# EAGLE board module (EAGLE 9.4.0), part 1 of 2
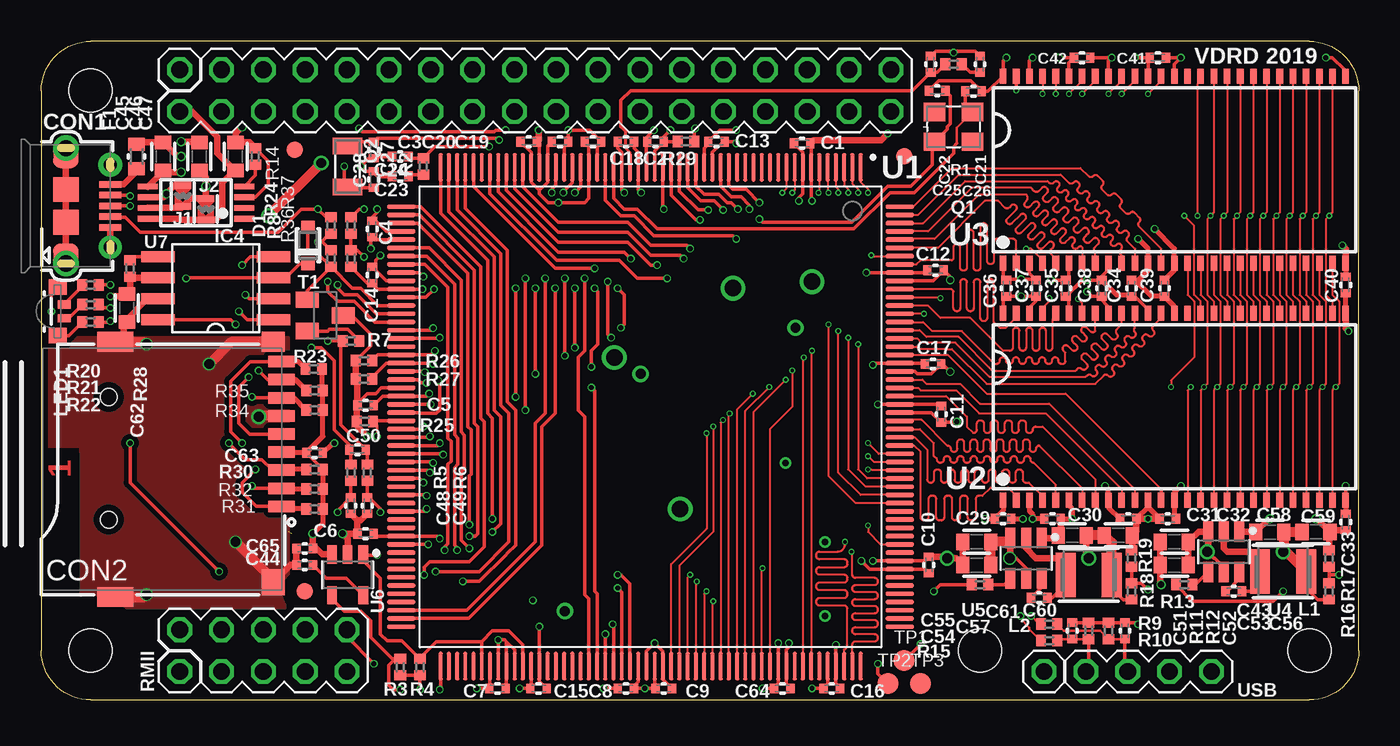
[diagram p5: board, top side]
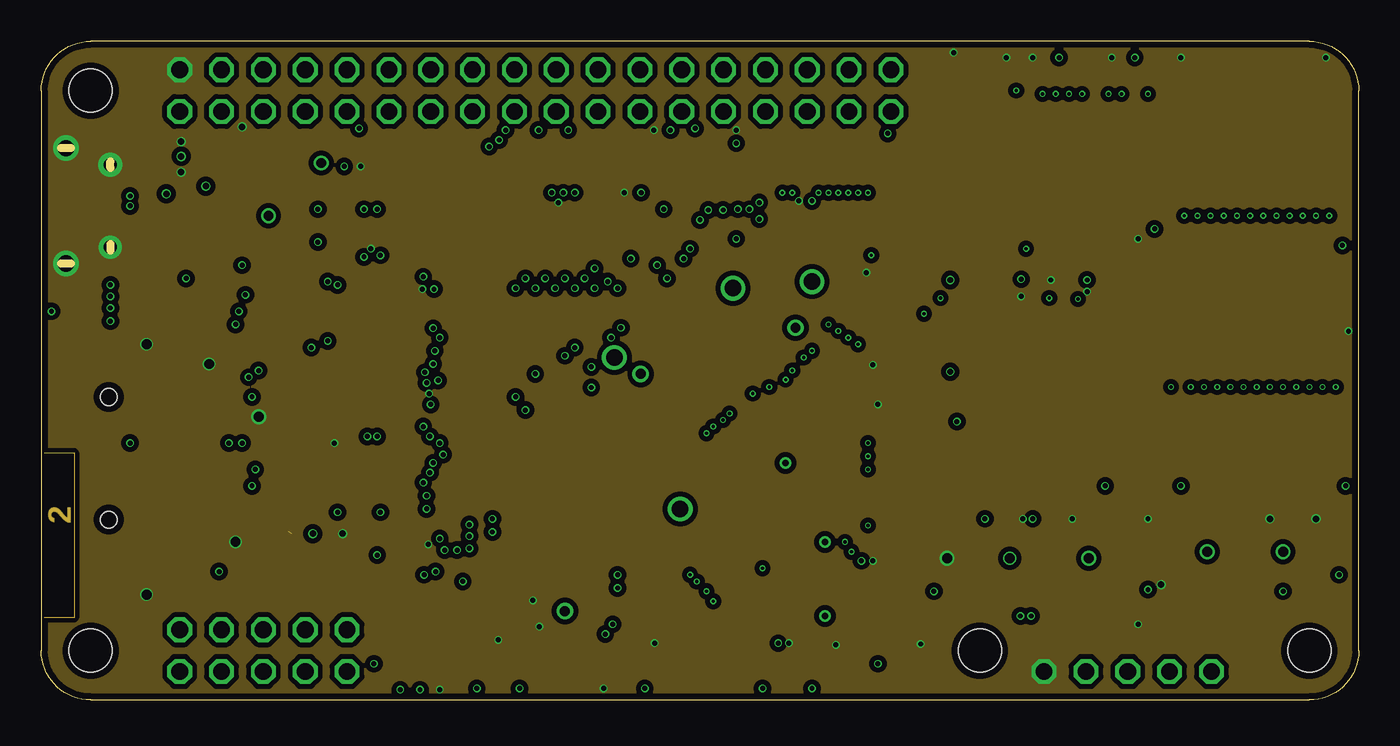
[diagram p6: board, inner layer Route2]
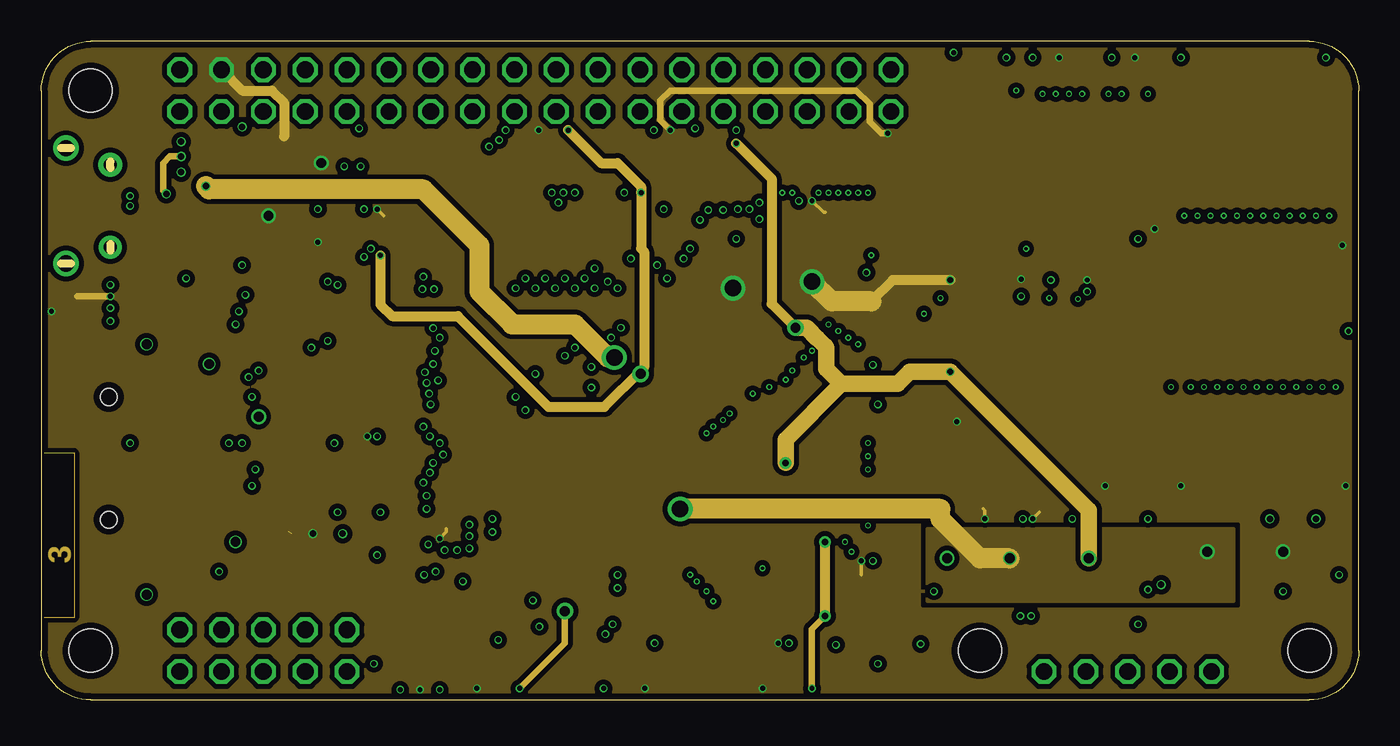
[diagram p7: board, inner layer Route15]
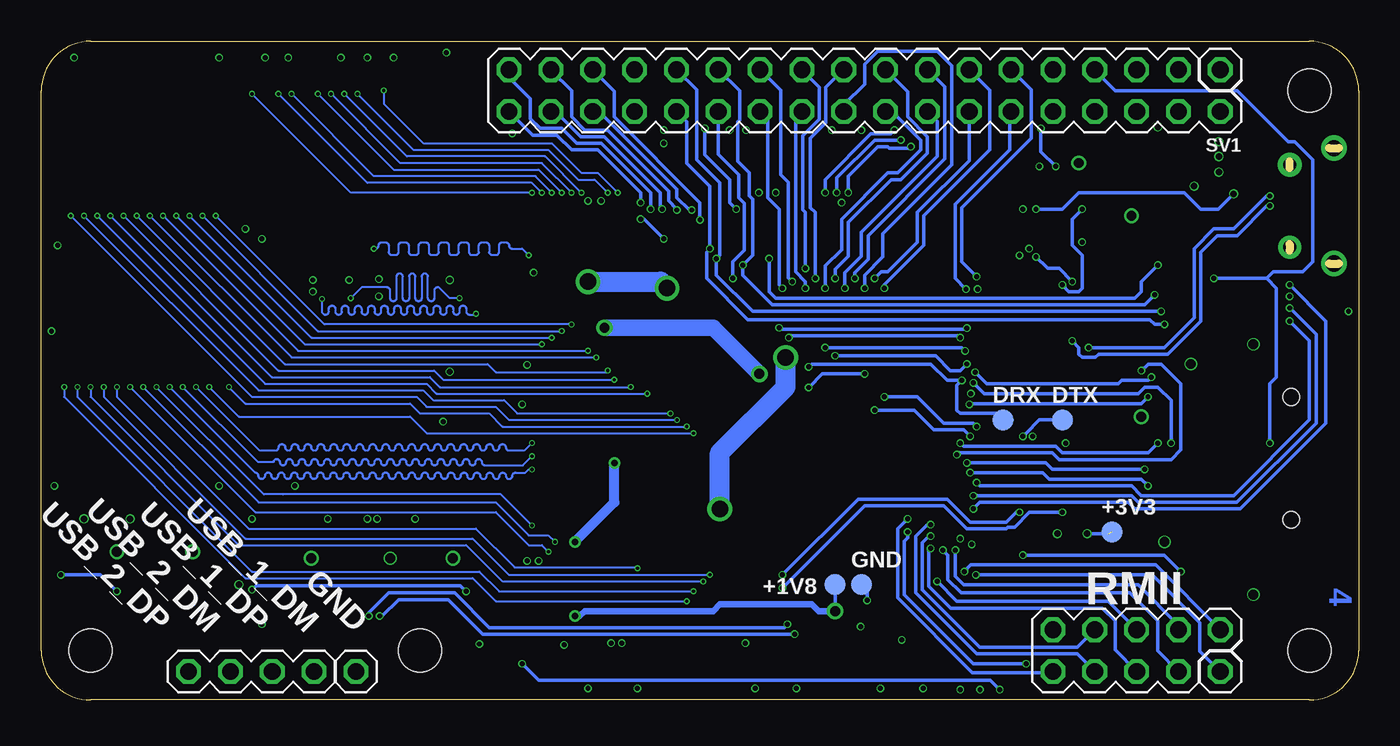
[diagram p8: board, bottom side, seen from below]

Size 80 x 40 mm. Coordinates in mm from the lower left corner, seen from the top.
Outline: 3,0 77,0 arc90 80,3 80,37 arc90 77,40 3,40 arc90 0,37 0,3 arc90 3,0
Copper layers (1+2*15+16): Top 0.035mm / dielectric 0.2mm / Route2 0.0175mm / dielectric 0.465mm / Route15 0.0175mm / dielectric 0.2mm / Bottom 0.035mm
Design rules "default *": minimum track width 4mil, minimum drill 0.2mm, track to track 4mil, track to pad 4mil, pad to pad 4mil, via to via 4mil, smd to smd 4mil, copper to edge 0.4mm, drill to drill 6mil, minimum pad ring 3mil, minimum via ring 3mil, stop-mask expansion 0.1mm, vias tented up to drill 0.3mm, thermal gap 10mil
Holes 2.6 mm at 3,37 3,3 77,3 57,3
tRestrict: area 0,34 to 6,40; area 0,0 to 6,6; area 74,0 to 80,6; area 54,0 to 60,6; area 0,5 to 2,15
bRestrict: area 0,34 to 6,40; area 0,0 to 6,6; area 74,0 to 80,6; area 54,0 to 60,6; area 0,5 to 2,15

## Footprints (pad centres in the part's own frame; a part is rotated, then mirrored left to right if it is on the bottom)
B1,27 = smd 1.27 x 1.27: TP 0,0
C0402K = smd 0.5 x 0.6: 1 -0.5,0; 2 0.5,0
C0603 = smd 0.8 x 1: 1 -0.85,0; 2 0.85,0
10118194 = smd 0.4 x 1.35: 1 -1.3,2.7; 2 -0.65,2.7; 3 0,2.7; 4 0.65,2.7; 5 1.3,2.7 | drill 0.8 pad 1.45: SH1 -2.5,2.7 | drill 0.8 pad 1.4: SH2 2.5,2.7 | drill 1 pad 1.55: SH3 -3.5,0; SH8 3.5,0 | smd 1.5 x 1.55: SH4 -3.05,0; SH5 -1,0; SH6 1,0; SH7 3.05,0
112J = smd 1.2 x 1.4: GND1 -7.75,-0.5 | smd 1.2 x 2.2: GND2 -7.75,-10.1; GND3 7.75,-10.1 | smd 1.6 x 1.4: GND4 6.85,-0.5 | smd 0.7 x 1.6: P$1 2.25,0; P$2 1.15,0; P$3 0.05,0; P$4 -1.05,0; P$5 -2.15,0; P$6 -3.25,0; P$7 -4.35,0; P$8 -5.45,0; P$13 -6.55,0 | hole 1: -4.4,-10.5; 3.05,-10.5
SOD323 = smd 0.8 x 0.8: A 1.1,0; K -1.1,0
F0603 = smd 0.8 x 1: 1 -0.75,0; 2 0.75,0
TSSOP8 = smd 1.2 x 0.35: 1 -2.925,0.975; 2 -2.925,0.325; 3 -2.925,-0.325; 4 -2.925,-0.975; 5 2.925,-0.975; 6 2.925,-0.325; 7 2.925,0.325; 8 2.925,0.975
C0603' = smd 0.4 x 1: 1 -0.65,0; 2 0.65,0
L3230M = smd 1.2 x 2.7: 1 -1.4,0; 2 1.4,0
321015RGB = smd 0.5 x 0.8: 1 -0.415,0.4; 4 0.415,0.4 | smd 0.95 x 1.1: 2 -1.475,0; 3 1.475,0
3215 = smd 1.3 x 1.1: 1 -1.15,-0.9; 2 1.15,-0.9; 3 1.15,0.9; 4 -1.15,0.9
3215' = smd 1 x 1.8: 1 -1.25,0; 2 1.25,0
R0402 = smd 0.6 x 0.7: 1 -0.5,0; 2 0.5,0
MA05-2 = drill 1.016 pad 1.5 octagon: 1 -5.08,-1.27; 2 -5.08,1.27; 3 -2.54,-1.27; 4 -2.54,1.27; 5 0,-1.27; 6 0,1.27; 7 2.54,-1.27; 8 2.54,1.27; 9 5.08,-1.27; 10 5.08,1.27
MA18-2 = drill 1.016 pad 1.5 octagon: 1 -21.59,-1.27; 2 -21.59,1.27; 3 -19.05,-1.27; 4 -19.05,1.27; 5 -16.51,-1.27; 6 -16.51,1.27; 7 -13.97,-1.27; 8 -13.97,1.27; 9 -11.43,-1.27; 10 -11.43,1.27; 11 -8.89,-1.27; 12 -8.89,1.27; 13 -6.35,-1.27; 14 -6.35,1.27; 15 -3.81,-1.27; 16 -3.81,1.27; 17 -1.27,-1.27; 18 -1.27,1.27; 19 1.27,-1.27; 20 1.27,1.27; 21 3.81,-1.27; 22 3.81,1.27; 23 6.35,-1.27; 24 6.35,1.27; 25 8.89,-1.27; 26 8.89,1.27; 27 11.43,-1.27; 28 11.43,1.27; 29 13.97,-1.27; 30 13.97,1.27; 31 16.51,-1.27; 32 16.51,1.27; 33 19.05,-1.27; 34 19.05,1.27; 35 21.59,-1.27; 36 21.59,1.27
SOT23-BEC = smd 1 x 1.4: B -0.95,-1.1; C 0,1.1; E 0.95,-1.1
QFP50P3120X3120X410-208N = smd 1.74 x 0.28: 1 -15.14,12.75; 2 -15.14,12.25; 3 -15.14,11.75; 4 -15.14,11.25; 5 -15.14,10.75; 6 -15.14,10.25; 7 -15.14,9.75; 8 -15.14,9.25; 9 -15.14,8.75; 10 -15.14,8.25; 11 -15.14,7.75; 12 -15.14,7.25; 13 -15.14,6.75; 14 -15.14,6.25; 15 -15.14,5.75; 16 -15.14,5.25; 17 -15.14,4.75; 18 -15.14,4.25; 19 -15.14,3.75; 20 -15.14,3.25; 21 -15.14,2.75; 22 -15.14,2.25; 23 -15.14,1.75; 24 -15.14,1.25; 25 -15.14,0.75; 26 -15.14,0.25; 27 -15.14,-0.25; 28 -15.14,-0.75; 29 -15.14,-1.25; 30 -15.14,-1.75; 31 -15.14,-2.25; 32 -15.14,-2.75; 33 -15.14,-3.25; 34 -15.14,-3.75; 35 -15.14,-4.25; 36 -15.14,-4.75; 37 -15.14,-5.25; 38 -15.14,-5.75; 39 -15.14,-6.25; 40 -15.14,-6.75; 41 -15.14,-7.25; 42 -15.14,-7.75; 43 -15.14,-8.25; 44 -15.14,-8.75; 45 -15.14,-9.25; 46 -15.14,-9.75; 47 -15.14,-10.25; 48 -15.14,-10.75; 49 -15.14,-11.25; 50 -15.14,-11.75; 51 -15.14,-12.25; 52 -15.14,-12.75; 105 15.14,-12.75; 106 15.14,-12.25; 107 15.14,-11.75; 108 15.14,-11.25; 109 15.14,-10.75; 110 15.14,-10.25; 111 15.14,-9.75; 112 15.14,-9.25; 113 15.14,-8.75; 114 15.14,-8.25; 115 15.14,-7.75; 116 15.14,-7.25; 117 15.14,-6.75; 118 15.14,-6.25; 119 15.14,-5.75; 120 15.14,-5.25; 121 15.14,-4.75; 122 15.14,-4.25; 123 15.14,-3.75; 124 15.14,-3.25; 125 15.14,-2.75; 126 15.14,-2.25; 127 15.14,-1.75; 128 15.14,-1.25; 129 15.14,-0.75; 130 15.14,-0.25; 131 15.14,0.25; 132 15.14,0.75; 133 15.14,1.25; 134 15.14,1.75; 135 15.14,2.25; 136 15.14,2.75; 137 15.14,3.25; 138 15.14,3.75; 139 15.14,4.25; 140 15.14,4.75; 141 15.14,5.25; 142 15.14,5.75; 143 15.14,6.25; 144 15.14,6.75; 145 15.14,7.25; 146 15.14,7.75; 147 15.14,8.25; 148 15.14,8.75; 149 15.14,9.25; 150 15.14,9.75; 151 15.14,10.25; 152 15.14,10.75; 153 15.14,11.25; 154 15.14,11.75; 155 15.14,12.25; 156 15.14,12.75 | smd 0.28 x 1.74: 53 -12.75,-15.14; 54 -12.25,-15.14; 55 -11.75,-15.14; 56 -11.25,-15.14; 57 -10.75,-15.14; 58 -10.25,-15.14; 59 -9.75,-15.14; 60 -9.25,-15.14; 61 -8.75,-15.14; 62 -8.25,-15.14; 63 -7.75,-15.14; 64 -7.25,-15.14; 65 -6.75,-15.14; 66 -6.25,-15.14; 67 -5.75,-15.14; 68 -5.25,-15.14; 69 -4.75,-15.14; 70 -4.25,-15.14; 71 -3.75,-15.14; 72 -3.25,-15.14; 73 -2.75,-15.14; 74 -2.25,-15.14; 75 -1.75,-15.14; 76 -1.25,-15.14; 77 -0.75,-15.14; 78 -0.25,-15.14; 79 0.25,-15.14; 80 0.75,-15.14; 81 1.25,-15.14; 82 1.75,-15.14; 83 2.25,-15.14; 84 2.75,-15.14; 85 3.25,-15.14; 86 3.75,-15.14; 87 4.25,-15.14; 88 4.75,-15.14; 89 5.25,-15.14; 90 5.75,-15.14; 91 6.25,-15.14; 92 6.75,-15.14; 93 7.25,-15.14; 94 7.75,-15.14; 95 8.25,-15.14; 96 8.75,-15.14; 97 9.25,-15.14; 98 9.75,-15.14; 99 10.25,-15.14; 100 10.75,-15.14; 101 11.25,-15.14; 102 11.75,-15.14; 103 12.25,-15.14; 104 12.75,-15.14; 157 12.75,15.14; 158 12.25,15.14; 159 11.75,15.14; 160 11.25,15.14; 161 10.75,15.14; 162 10.25,15.14; 163 9.75,15.14; 164 9.25,15.14; 165 8.75,15.14; 166 8.25,15.14; 167 7.75,15.14; 168 7.25,15.14; 169 6.75,15.14; 170 6.25,15.14; 171 5.75,15.14; 172 5.25,15.14; 173 4.75,15.14; 174 4.25,15.14; 175 3.75,15.14; 176 3.25,15.14; 177 2.75,15.14; 178 2.25,15.14; 179 1.75,15.14; 180 1.25,15.14; 181 0.75,15.14; 182 0.25,15.14; 183 -0.25,15.14; 184 -0.75,15.14; 185 -1.25,15.14; 186 -1.75,15.14; 187 -2.25,15.14; 188 -2.75,15.14; 189 -3.25,15.14; 190 -3.75,15.14; 191 -4.25,15.14; 192 -4.75,15.14; 193 -5.25,15.14; 194 -5.75,15.14; 195 -6.25,15.14; 196 -6.75,15.14; 197 -7.25,15.14; 198 -7.75,15.14; 199 -8.25,15.14; 200 -8.75,15.14; 201 -9.25,15.14; 202 -9.75,15.14; 203 -10.25,15.14; 204 -10.75,15.14; 205 -11.25,15.14; 206 -11.75,15.14; 207 -12.25,15.14; 208 -12.75,15.14
TSOP54-400 = smd 0.4 x 0.9: 1 -10.4,-5.68; 2 -9.6,-5.68; 3 -8.8,-5.68; 4 -8,-5.68; 5 -7.2,-5.68; 6 -6.4,-5.68; 7 -5.6,-5.68; 8 -4.8,-5.68; 9 -4,-5.68; 10 -3.2,-5.68; 11 -2.4,-5.68; 12 -1.6,-5.68; 13 -0.8,-5.68; 14 0,-5.68; 15 0.8,-5.68; 16 1.6,-5.68; 17 2.4,-5.68; 18 3.2,-5.68; 19 4,-5.68; 20 4.8,-5.68; 21 5.6,-5.68; 22 6.4,-5.68; 23 7.2,-5.68; 24 8,-5.68; 25 8.8,-5.68; 26 9.6,-5.68; 27 10.4,-5.68; 28 10.4,5.68; 29 9.6,5.68; 30 8.8,5.68; 31 8,5.68; 32 7.2,5.68; 33 6.4,5.68; 34 5.6,5.68; 35 4.8,5.68; 36 4,5.68; 37 3.2,5.68; 38 2.4,5.68; 39 1.6,5.68; 40 0.8,5.68; 41 0,5.68; 42 -0.8,5.68; 43 -1.6,5.68; 44 -2.4,5.68; 45 -3.2,5.68; 46 -4,5.68; 47 -4.8,5.68; 48 -5.6,5.68; 49 -6.4,5.68; 50 -7.2,5.68; 51 -8,5.68; 52 -8.8,5.68; 53 -9.6,5.68; 54 -10.4,5.68
SOT95P280X110-6 = smd 1.259 x 0.609: 1 -1.228,0.95; 2 -1.228,0; 3 -1.228,-0.95; 4 1.228,-0.95; 5 1.228,0; 6 1.228,0.95
SOT95P280X100-5 = smd 1.116 x 0.589: 1 -1.242,0.95; 2 -1.242,0; 3 -1.242,-0.95; 4 1.242,-0.95; 5 1.242,0.95
SO08-208 = smd 0.66 x 2.032: 1 -1.905,-3.498; 2 -0.635,-3.498; 3 0.635,-3.498; 4 1.905,-3.498; 5 1.905,3.498; 6 0.635,3.498; 7 -0.635,3.498; 8 -1.905,3.498
FIDUCIAL_1MM = smd 1 x 1: 1 0,0
MA05-1 = drill 1.016 pad 1.5 octagon: 1 -5.08,0; 2 -2.54,0; 3 0,0; 4 2.54,0; 5 5.08,0

## Placement (x,y rotation side)
+1V8  PTR1B1,27  [B1,27]  31.8,7 0 bottom
+3V3  PTR1B1,27  [B1,27]  15,10.2 0 bottom
C1  100nF  [C0402K]  46.2,33.8 180 top
C2  100nF  [C0402K]  37.3,33.9 180 top
C3  100nF  [C0402K]  29.6,33.9 180 top
C4  100nF  [C0402K]  20.1,28.6 270 top
C5  100nF  [C0402K]  19.7,17.9 0 top
C6  100nF  [C0402K]  19.7,10.1 180 top
C7  100nF  [C0402K]  27.7,0.7 0 top
C8  100nF  [C0402K]  35.5,0.7 180 top
C9  100nF  [C0402K]  37.8,0.7 0 top
C10  100nF  [C0402K]  53.9,8.2 90 top
C11  100nF  [C0402K]  54.65,17.35 90 top
C12  100nF  [C0402K]  54.3,26.1 180 top
C13  100nF  [C0402K]  41,33.9 180 top
C14  100nF  [C0402K]  20.1,25.8 270 top
C15  100nF  [C0402K]  30.2,0.7 0 top
C16  100nF  [C0402K]  48,0.7 0 top
C17  100nF  [C0402K]  54.15,20.4 180 top
C18  100nF  [C0402K]  35.5,33.9 180 top
C19  100nF  [C0402K]  33.5,33.9 180 top
C20  100nF  [C0402K]  31.5,33.9 180 top
C21  5.6nF  [C0402K]  57,38.6 90 top
C22  680pF  [C0402K]  54,38.6 90 top
C23  4.7nF  [C0402K]  21.8,31.8 180 top
C24  470pF  [C0402K]  21.8,33 180 top
C25  9pF  [C0402K]  54.4,37 180 top
C26  9pF  [C0402K]  56.6,36.95 0 top
C27  15pF  [C0402K]  20.2,33.4 270 top
C28  15pF  [C0402K]  20.2,31.6 90 top
C29  100nF  [C0402K]  58.4,11 0 top
C30  100nF  [C0402K]  61.4,11 0 top
C31  100nF  [C0402K]  66,11 0 top
C32  100nF  [C0402K]  68.4,11 180 top
C33  100nF  [C0402K]  79.2,10.8 270 top
C34  100nF  [C0402K]  66.2,25 90 top
C35  100nF  [C0402K]  62.2,25 90 top
C36  100nF  [C0402K]  58.6,25 270 top
C37  100nF  [C0402K]  60.4,25 270 top
C38  100nF  [C0402K]  64.4,25 270 top
C39  100nF  [C0402K]  68.2,25 270 top
C40  100nF  [C0402K]  79.2,25.2 270 top
C41  100nF  [C0402K]  67.8,39 0 top
C42  100nF  [C0402K]  63.2,39 0 top
C43  10uF  [C0603]  68.8,9.6 180 top
C44  330nF  [C0402K]  16,8.2 180 top
C45  10uF  [C0603]  7.4,33 270 top
C46  10uF  [C0603]  9.6,33 90 top
C47  10uF  [C0603]  11.8,33 90 top
C48  15pF  [C0402K]  18.8,11.8 270 top
C49  15pF  [C0402K]  19.8,11.8 270 top
C50  33pF  [C0402K]  19.2,15.2 0 top
C51  15pF  [C0402K]  62.6,4.2 90 top
C52  15pF  [C0402K]  65.8,4.2 90 top
C53  10uF  [C0603]  68.8,8.2 180 top
C54  10uF  [C0603]  56.8,8.2 180 top
C55  10uF  [C0603]  56.8,9.6 180 top
C56  1uF  [C0402K]  72.4,6.6 0 top
C57  1uF  [C0402K]  60.6,6.2 0 top
C58  10uF  [C0603]  74.6,10.2 180 top
C59  10uF  [C0603]  77.4,10.2 0 top
C60  10uF  [C0603]  65.4,10 0 top
C61  10uF  [C0603]  62.6,10 180 top
C62  1uF  [C0603]  5.2,23.8 270 top
C63  100nF  [C0402K]  16.6,15 0 top
C64  100nF  [C0402K]  45,0.7 0 top
C65  100nF  [C0402K]  16,9.2 180 top
CON1  microusb  [10118194]  1.5,30 270 top
CON2  microSD  [112J]  14.6,14 270 top
D1  1n4148  [SOD323]  16.2,27.6 90 top
DRX  PTR1B1,27  [B1,27]  21.6,17 0 bottom
DTX  PTR1B1,27  [B1,27]  18,17 0 bottom
F1  500mA  [F0603]  5.8,33 90 top
GND  PTR1B1,27  [B1,27]  30.2,7 0 bottom
IC4  TPS2115A  [TSSOP8]  9.4,30.2 180 top
J1  JUMP-0603  [C0603']  8.6,30.6 270 top
J2  JUMP-0603  [C0603']  10,29.8 270 top
L1  4.7uH  [L3230M]  75.4,7.8 0 top
L2  2.2uH  [L3230M]  63.6,7.6 0 top
LED1  [321015RGB]  1,23.6 270 top
Q1  18.432MHz  [3215]  55.4,34.8 0 top
Q2  32.768kHz  [3215']  18.6,32.4 270 top
R1  1.27k  [R0402]  55.4,38.6 180 top
R2  1.96k  [R0402]  23.2,32.4 90 top
R3  47k  [R0402]  21.8,2 90 top
R4  47k  [R0402]  23,2 90 top
R5  27  [R0402]  18.8,13.8 270 top
R6  27  [R0402]  19.8,13.8 270 top
R7  1k5  [R0402]  18.8,21.8 180 top
R8  47k  [R0402]  17.6,26.8 90 top
R9  27  [R0402]  61.2,4.6 0 top
R10  27  [R0402]  61.2,3.6 0 top
R11  15k  [R0402]  63.6,4.2 270 top
R12  15k  [R0402]  64.8,4.2 270 top
R13  75k  [R0402]  69.4,7 180 top
R14  240  [R0402]  13,33 270 top
R15  75k  [R0402]  57,7 180 top
R16  47k  [R0402]  78.2,6.6 270 top
R17  15k  [R0402]  78.2,8.6 90 top
R18  15k  [R0402]  66.2,6.6 270 top
R19  12k  [R0402]  66.2,8.6 90 top
R20  180  [R0402]  3,25.2 180 top
R21  180  [R0402]  3,24 180 top
R22  180  [R0402]  3,22.95 180 top
R23  47k  [R0402]  16.55,20.1 180 top
R24  47k  [R0402]  17.6,28.8 270 top
R25  47k  [R0402]  19.65,16.9 180 top
R26  1.8k  [R0402]  19.6,20.6 180 top
R27  1.8k  [R0402]  19.6,19.5 180 top
R28  47k  [R0402]  5.4,26.2 270 top
R29  47k  [R0402]  39.15,33.9 180 top
R30  47k  [R0402]  16.6,14 0 top
R31  47k  [R0402]  16.6,11.6 180 top
R32  47k  [R0402]  16.6,12.8 180 top
R34  47k  [R0402]  16.6,17.6 180 top
R35  47k  [R0402]  16.6,18.8 180 top
R36  22k  [R0402]  18.8,26.8 90 top
R37  15k  [R0402]  18.8,28.8 90 top
RMII  header  [MA05-2]  13.49,3 0 top
SV1  header  [MA18-2]  30,37 180 bottom
T1  [SOT23-BEC]  17.25,23.35 270 top
TP1  PTR1B1,27  [B1,27]  52.4,2.4 0 top
TP2  PTR1B1,27  [B1,27]  51.4,1 0 top
TP3  PTR1B1,27  [B1,27]  53.4,1 0 top
U1  AT91RM9200-QU-002  [QFP50P3120X3120X410-208N]  37,17.2 270 top
U2  MT48LC16M16A2  [TSOP54-400]  68.8,17.8 0 top
U3  MT48LC16M16A2  [TSOP54-400]  68.8,32.2 0 top
U4  AP65211A  [SOT95P280X110-6]  71.8,9 270 top
U5  AP65211A  [SOT95P280X110-6]  59.8,8.6 270 top
U6  [SOT95P280X100-5]  18.6,7.6 270 top
U7  AT45DB-S  [SO08-208]  10.6,25 90 top
U$1  FIDUCIAL  [FIDUCIAL_1MM]  15.4,33.4 0 top
U$2  FIDUCIAL  [FIDUCIAL_1MM]  16,6.6 0 top
U$3  FIDUCIAL  [FIDUCIAL_1MM]  52.4,33 0 top
USB  header  [MA05-1]  65.97,1.73 0 top

## Tracks (layer width: path | path; a pad name or v marks a point on that pad's centre or on a via)
31  (via drill 0.3)
  Top 0.2: v40,29.15 39.75,29.15 38.25,30.65 U1.24
  Bottom 0.2: SV1.31 45.2,36.96 45.2,35.4 40,30.2 v40,29.15
32  (via drill 0.3)
  Top 0.2: v40.5,29.75 39.9,29.75 38.75,30.9 U1.23
  Bottom 0.2: SV1.32 46.13,35.73 41.4,31 41.4,30.5 40.65,29.75 v40.5,29.75
33  (via drill 0.3)
  Top 0.2: v41.4,29.75 40.85,30.3 40.05,30.3 39.25,31.1 U1.22
  Bottom 0.2: SV1.33 49.05,38.25 47.8,37 47.8,35.4 47,34.6 45.6,34.6 41.9,30.9 41.9,30.3 41.4,29.8 v41.4,29.75
34  (via drill 0.3)
  Top 0.2: U1.21 39.75,31.2 40.25,30.7 41.15,30.7 41.65,30.2 41.9,30.2 v42.3,29.8
  Bottom 0.2: SV1.34 48.72,35.4 48.45,35.4 47.25,34.2 45.8,34.2 42.4,30.8 42.4,30.1 42.4,29.95 42.3,29.85 v42.3,29.8
35  (via drill 0.3)
  Top 0.2: v43,29.8 43,30.05 42.5,30.55 41.9,30.55 41.25,31.2 U1.18
  Bottom 0.2: SV1.35 51.59,37.79 50.3,36.5 50.3,35.3 49.7,34.7 48.4,34.7 47.5,33.8 46,33.8 43,30.8 v43,29.8
36  (via drill 0.3)
  Top 0.2: v43.6,30.2 42.8,31 42,31 41.75,31.25 U1.17
  Bottom 0.2: SV1.36 50.16,34.3 48.7,34.3 47.8,33.4 46.2,33.4 43.6,30.8 v43.6,30.2
!MRST  (via drill 0.3)
  Top 0.2: TP2.TP 50.8,1.6 v50.8,2.2 | v21.8,0.63 21.37,0.63 21.1,0.9 21.1,2.1 21.5,2.5 R3.2 21.3,2.5 20,3.8 20,4.8 19.4,5.4 18.4,5.4 17.65,6.15 U6.4
  Bottom 0.2: v50.8,2.2 49.8,1.2 22.37,1.2 v21.8,0.63
!RST  (via drill 0.3)
  Top 0.2: U1.115 29.25,3.35 28.4,4.2 27.4,4.2 26.75,3.55 | U1.110 26.75,3.55 | 26.75,3.55 24,3.55 23,2.55 R4.2 21.9,3.6 21,3.6 20.6,4 20.6,7.39 19.55,8.44 U6.1 19.59,8.8 v20.4,8.8 | v8.8,25.6 8.84,25.64 14,25.64 U7.3 14.84,25.64 15.7,26.5 D1.K | v5.4,15.6 5.4,13.2 v10.8,7.8
  Bottom 0.2: v8.8,25.6 5.6,25.6 | SV1.7 16.03,38.23 14.8,37 7.38,37 4.28,33.9 3.9,33.9 2.8,32.8 2.8,26.6 3.4,26 5.2,26 5.6,25.6 | 5.6,25.6 5,25 5,19.6 5.4,19.2 v5.4,15.6 | v10.8,7.8 11.8,8.8 v20.4,8.8
+1V8  (via drill 0.3, 0.35, 0.4 pad 0.7, 0.6 pad 0.9, 0.6 pad 1)
  Top 0.2: U1.62 20.95,25.45 C14.1 20.3,26.5 20.3,26.7 v20.6,27 | U1.188 53.05,19.95 53.2,19.8 54.05,19.8 C17.1 54.73,20.4 v55.2,19.93 | C18.1 36,33.5 36.25,33.25 U1.28 36.25,30.98 v36.43,30.8 | U1.33 33.75,33.65 C19.1 33.3,34.6 v32,34.6 C20.1 31.75,33.65 U1.37 | R18.2 65.7,6.1 65,6.8 L2.2 | U1.152 47.75,0.95 C16.1 v46.8,0.7 | U1.116 29.75,0.75 C15.1 v29.05,0.7 | U1.19 40.75,33.25 41.4,33.9 C13.1 42.1,33.9 v42.2,33.8
  Top 0.4: C61.1 63.45,8.75 v63.6,8.6
  Top 0.6: L2.2 65,9.55 C60.1 C61.1
  Route15 0.4: v29.05,0.7 31.8,3.45 v31.8,5.4 | v46.8,0.7 46.8,4.3 v47.6,5.1 | 48.6,19.2 47.68,20.12 | 46.54,22.54 46.48,22.6
  Route15 0.6: v47.6,5.1 v47.6,9.6 | 48.5,19.1 48.6,19.2 | v42.2,33.8 44.35,31.65 44.35,24.05 v45.8,22.6 | v32,34.6 34,32.6 35,32.6 36.43,31.17 v36.43,30.8 36.43,27.4 36.6,27.23 36.6,20.2 36.4,20 | v20.6,27 20.6,24 21.3,23.3 25.3,23.3 30.8,17.8 34.2,17.8 36.4,20 | 36.4,20 v36.4,19.8
  Route15 1: v63.6,8.6 63.6,11.53 v55.2,19.93 52.73,19.93 52,19.2 48.6,19.2 | 46.54,22.54 47.1,21.98 47.12,21.98 47.58,21.52 47.58,21.5 47.68,21.4 47.68,20.12 48.5,19.3 48.5,19.1 45.2,15.8 v45.2,14.4 | 46.48,22.6 v45.8,22.6
  Bottom 0.2: v31.8,5.4 +1V8.TP
  Bottom 0.4: v31.8,5.4 32.8,5.4 33.2,5.8 38.8,5.8 39.2,5.4 47,5.4 47.3,5.1 v47.6,5.1
  Bottom 0.6: v47.6,9.6 45.2,12 v45.2,14.4
  Bottom 1: v45.8,22.6 39.2,22.6 v36.4,19.8
+3V3  (via drill 0.3, 0.35, 0.4, 0.6 pad 0.9, 1 pad 1.5)  (1 unrouted)
  Top 0.2: U1.183 54.05,17.45 C11.1 55.55,16.85 v55.6,16.9 | U3.49 62.4,38.7 C42.1 v61.8,39 | U3.43 67.2,38.9 C41.1 v66.4,39 | 60.08,26.52 U3.3 60,25.9 C37.1 60.35,25.55 v59.5,25.55 58.65,25.55 C36.1 58.4,25.7 U3.1 | 64.8,26.21 U3.9 64.8,26.12 64.4,25.72 C38.1 63.6,25.5 v63.5,25.5 | U1.56 20.95,28.45 20.3,29.1 C4.1 20.1,29.3 20.4,29.6 v20.4,29.8 | C10.1 53.65,7.95 U1.164 50.3,7.95 v49.8,8.45 | U2.49 62.4,24.3 C35.1 | C34.1 66.4,24.5 67.2,23.7 U2.43 | U1.199 54.15,25.45 C12.1 55.2,25.7 v55.2,25.5 | 46.8,33.9 C1.1 46.75,33.75 U1.7 46.75,30.35 v46.8,30.3 | U1.40 30.25,33.75 C3.1 | R16.2 77.5,6.1 76.8,6.8 L1.2 | U2.27 v79.2,13 | U1.129 36.25,1.1 36,0.85 C8.1 v36.65,0.7 C9.1 37.3,0.75 37.25,0.8 U1.131 | U1.111 27.25,0.75 C7.1 v26.45,0.7 | LED1.2 0.63,24.7 v0.63,23.6 | v43.8,0.7 C64.1 44.75,0.95 U1.146 v44.75,3.45 | U7.6 6.18,25.64 | U1.26 37.25,33.35 C2.1 | C2.1 37.8,34.2 v38.2,34.6 | v23,0.63 R4.1 R3.1 | C65.1 | C6.1 20.35,9.95 U1.93 24.05,9.95 v24.2,9.8 | R8.2 17.1,27.8 17,27.8 | 17,27.8 v16.8,27.8 | R24.2 17.5,28.3 17,27.8 | U1.75 20.65,18.95 20.3,18.6 19.8,18.6 19.2,18 C5.1 | R26.2 20,21.5 20,22.2 18.85,23.35 T1.C | R29.2 C2.1 | R30.2 C63.1
  Top 0.25: C35.1 63.2,25.5 63.6,25.5
  Top 0.3: U2.1 58.4,11.5 C29.1 v57.3,11 | C30.1 v60.2,11 60.2,11.28 60,11.48 U2.3 | C31.1 64.8,11.7 U2.9 64.8,12.8 v64.6,13 | C32.1 68.8,11.1 U2.14 68.8,12.6 v69.2,13 | C39.1 68.8,26.1 U3.14 68.8,27.4 v67.6,28.6 | C38.1 65.3,24.6 66.1,24.6 C34.1 | U3.27 C40.1 | U2.27 C33.1 | R30.2 R32.1 R31.1 17.1,10.7 v16.5,10.1 | CON2.P$4 14.65,15 C63.1 17.1,16 R34.1 R35.1 17.05,18.85 R23.1
  Top 0.4: C3.1 30.2,34 v30.2,34.6 | U3.27 79.2,27.4 v79,27.6 | U7.6 5.46,25.64 R28.2 5.4,24.85 C62.1 5.05,24.5 v4.2,24.5 | v51.4,34.4 51,34 46.9,34 C1.1 | U6.3 17.06,8.84 16.7,9.2 C65.1 v16.5,10.1 | R26.2 R27.2 19.2,19.4 C5.1 19.15,17.85 R25.2 19.15,16.65 v19.8,16
  Top 0.6: C59.1 C58.1 75.45,9.05 v75.4,9 75.6,9 L1.2 | v17,32.6 v13.8,29.4
  Route15 0.2: v49.8,8.45 49.8,7.6 | v46.8,30.3 47.5,29.6 47.6,29.6 | v24.2,9.8 24.6,10.2 24.6,10.4 | v57.3,11 57.3,11.5 57.2,11.6 | v60.2,11 60.6,11.4 | v20.4,29.8 20.8,29.4
  Route15 0.4: v4.2,24.5 2.2,24.5 | v38.2,34.6 37.6,35.2 37.6,36.4 38.2,37 49.5,37 50.3,36.2 50.3,35.1 51,34.4 v51.4,34.4
  Route15 0.6: SV1.3 12.22,37 14,37 14.75,36.25 14.75,34.2 | v55.2,25.5 51.7,25.5 50.4,24.2
  Route15 1.2: 50.4,24.2 48,24.2 v46.8,25.4
  Bottom 0.2: v16.5,10.1 15.2,10.1
  Bottom 1.2: v46.8,25.4 42.4,25.4 v42,25
  pour Route15 (isolate 0.3, rank 6, no thermals): -2,-2 -2,42 82,42 82,-2
+5V  (via drill 0.4, 0.6 pad 0.8, 0.6 pad 0.9, 1 pad 1.5)
  Top 0.2: 59.8,7 U5.5 59.8,8 59.2,8.6 v58.8,8.6 | v70.8,9 71.2,8.6 71.24,8.6 71.8,8.04 U4.5
  Top 0.4: U5.3 58.85,8.65 v58.8,8.6 | C46.1 10,31.75 v10,31.2 J2.1 9.1,30.45 J1.2 8.53,29.88 IC4.7 | C53.1 C43.1 70.28,10.23 U4.3 70.85,9.05 v70.8,9
  Top 0.6: C54.1 C55.1 58.62,9.6 U5.3
  Route15 1.2: v58.8,8.6 57,8.6 54.6,11 54.6,11.6 v38.8,11.6 | v10,31.2 10.2,31 23.2,31 26.6,27.6 26.6,24.8 28.6,22.8 32.4,22.8 34.4,20.8 v34.8,20.8
  Bottom 1.2: v38.8,11.6 38.8,15 34.8,19 v34.8,20.8
  pour Route15 (isolate 0.3, rank 2): 72.4,10.4 72.4,6 53.8,6 53.8,10.4
ADDR0  (via drill 0.2)
  Top 0.127: U1.133 38.25,8.25 40.4,10.4 v40.4,16.2 | v69.8,19 69.6,18.8 U2.15
  Bottom 0.127: v69.8,19 68,17.2 57.6,17.2 56.6,16.2 v40.4,16.2
ADDR1  (via drill 0.2)
  Top 0.127: U3.15 69.6,24.6 70,24.2 70,20.8 68.6,19.4 v68.6,19 | v40.8,16.6 40.8,10.2 38.75,8.15 U1.134
  Bottom 0.127: v68.6,19 67.6,18 57.6,18 57,17.4 52.8,17.4 52,16.6 v40.8,16.6
ADDR2  (via drill 0.2)
  Top 0.127: U3.23 76,24.6 76.4,24.2 76.4,19.2 v76.2,19 76,18.8 U2.23 | U1.135 39.25,7.45 v39.4,7.6
  Bottom 0.127: v76.2,19 76.2,18.4 67.6,9.8 53.8,9.8 51.6,7.6 v39.4,7.6
ADDR3  (via drill 0.2)
  Top 0.127: U3.24 76.8,24.6 77.2,24.2 77.2,19.2 v77,19 76.8,18.8 U2.24 | v39.8,7.2 39.75,7.15 U1.136
  Bottom 0.127: v77,19 77,18.4 68,9.4 54.2,9.4 52,7.2 v39.8,7.2
ADDR4  (via drill 0.2)
  Top 0.127: U3.25 77.6,24.6 78,24.2 78,19.2 v77.8,19 77.6,18.8 U2.25 | v40.4,6.6 40.25,6.45 U1.137
  Bottom 0.127: v77.8,19 77.8,18.4 67.2,7.8 53.4,7.8 52.2,6.6 v40.4,6.6
ADDR5  (via drill 0.2)
  Top 0.127: U3.26 78.4,24.6 78.8,24.2 78.8,19.2 v78.6,19 78.4,18.8 U2.26 | v40.8,6 40.75,5.95 U1.138
  Bottom 0.127: v78.6,19 78.6,18.4 67.6,7.4 53.8,7.4 52.4,6 v40.8,6
ADDR6  (via drill 0.2)
  Top 0.127: U3.29 78.4,29.6 v78.2,29.4 78,29.2 78,24.6 78.4,24.2 U2.29 | U1.139 41.25,16.85 v41.4,17
  Bottom 0.127: v78.2,29.4 67.2,18.4 57.2,18.4 56.6,17.8 52.4,17.8 51.6,17 v41.4,17
ADDR7  (via drill 0.2)
  Top 0.127: U3.30 77.6,29.6 v77.4,29.4 77.2,29.2 77.2,24.6 77.6,24.2 U2.30 | U1.140 41.75,17.35 v41.8,17.4
  Bottom 0.127: v77.4,29.4 66.8,18.8 56.8,18.8 56.2,18.2 51.9,18.2 51.1,17.4 v41.8,17.4
ADDR8  (via drill 0.2)
  Top 0.127: U3.31 76.8,29.6 v76.6,29.4 76.4,29.2 76.4,24.6 76.8,24.2 U2.31 | U1.141 42.25,17.65 v43.2,18.6
  Bottom 0.127: v76.6,29.4 66.4,19.2 56.6,19.2 56,18.6 v43.2,18.6
ADDR9  (via drill 0.2)
  Top 0.127: U3.32 76,29.6 v75.8,29.4 75.6,29.2 75.6,24.6 76,24.2 U2.32 | U1.142 42.75,17.55 v44.2,19
  Bottom 0.127: v75.8,29.4 66,19.6 56.4,19.6 55.8,19 v44.2,19
ADDR10  (via drill 0.2)
  Top 0.127: U3.33 75.2,29.6 v75,29.4 74.8,29.2 74.8,24.6 75.2,24.2 U2.33 | U1.143 43.25,17.5 v45.2,19.45
  Bottom 0.127: v75,29.4 65.6,20 56.15,20 55.6,19.45 v45.2,19.45
ADDR11  (via drill 0.2)
  Top 0.127: U3.34 74.4,29.6 v74.2,29.4 74,29.2 74,24.6 74.4,24.2 U2.34 | v45.6,20 45.6,17.8 44.25,16.45 U1.145
  Bottom 0.127: v74.2,29.4 65.2,20.4 52.9,20.4 52.4,19.9 45.7,19.9 v45.6,20
ADDR13  (via drill 0.2)
  Top 0.127: U3.35 73.6,29.6 v73.4,29.4 73.2,29.2 73.2,24.6 73.6,24.2 U2.35 | v46.3,20.8 46.25,20.75 U1.149
  Bottom 0.127: v73.4,29.4 64.8,20.8 v46.3,20.8
ADDR14  (via drill 0.2)
  Top 0.127: U3.36 72.8,29.6 v72.6,29.4 72.4,29.2 72.4,24.6 72.8,24.2 U2.36 | v46.8,21.2 46.75,21.15 U1.150
  Bottom 0.127: v72.6,29.4 64.4,21.2 v46.8,21.2
ADDR16  (via drill 0.2)
  Top 0.127: U3.20 73.6,24.6 74,24.2 74,19.2 v73.8,19 73.6,18.8 U2.20 | U1.154 48.75,3.06 48.95,3.26 48.95,5.54 arc90 48.76,5.73 47.25,5.73 arc-90 47.06,5.92 47.06,6.01 arc-90 47.25,6.2 48.76,6.2 arc90 48.95,6.39 48.95,6.48 arc90 48.76,6.67 47.25,6.67 arc-90 47.06,6.86 47.06,6.95 arc-90 47.25,7.14 48.76,7.14 arc90 48.95,7.33 48.95,7.41 arc90 48.76,7.61 47.25,7.61 arc-90 47.06,7.79 47.06,7.88 arc-90 47.25,8.07 48.76,8.07 arc90 48.95,8.26 48.95,8.35 arc90 48.76,8.54 47.25,8.54 arc-90 47.06,8.73 47.06,8.82 arc-90 47.25,9.01 48.36,9.01 arc90 48.8,9.45 v48.8,9.6
  Bottom 0.127: v73.8,19 66.8,12 52.4,12 50.4,10 49.2,10 v48.8,9.6
ADDR17  (via drill 0.2)
  Top 0.127: U3.21 74.4,24.6 74.8,24.2 74.8,19.2 v74.6,19 74.4,18.8 U2.21 | v49.2,9 49.25,8.95 49.25,7.6 arc90 49.44,7.41 50.61,7.41 arc-90 50.8,7.22 50.8,7.17 arc-90 50.61,6.98 49.44,6.98 arc90 49.25,6.79 49.25,6.75 arc90 49.44,6.55 50.61,6.55 arc-90 50.8,6.36 50.8,6.32 arc-90 50.61,6.13 49.44,6.13 arc90 49.25,5.94 49.25,5.89 arc90 49.44,5.7 50.61,5.7 arc-90 50.8,5.51 50.8,5.46 arc-90 50.61,5.27 49.44,5.27 arc90 49.25,5.08 49.25,5.04 arc90 49.44,4.85 50.61,4.85 arc-90 50.8,4.66 50.8,4.61 arc-90 50.61,4.42 49.44,4.42 arc90 49.25,4.23 49.25,4.18 arc90 49.44,3.99 50.61,3.99 arc-90 50.8,3.8 50.8,3.75 arc-90 50.61,3.56 49.44,3.56 arc90 49.25,3.37 U1.155
  Bottom 0.127: v74.6,19 67,11.4 52.4,11.4 50.4,9.4 49.6,9.4 v49.2,9
BMS  (via drill 0.3)
  Top 0.152: R25.1 20.4,16.65 v20.4,16
  Top 0.2: U1.79 20.2,16.95 R25.1
  Bottom 0.2: v20.4,16 20.23,16.17 20.23,16.18 19.41,17 DTX.TP
CAPE_EN1  (via drill 0.3)
  Top 0.2: U1.80 23.05,16.45 v23.2,16.6 | v28.8,18.4 v28.8,25
  Bottom 0.2: SV1.13 22.4,37.02 22.4,33.4 26.4,29.4 26.4,27.6 28.8,25.2 v28.8,25 | v28.8,18.4 26.8,18.4 25.2,16.8 23.4,16.8 v23.2,16.6
CAPE_EN2  (via drill 0.3)
  Top 0.2: U1.81 23.55,15.95 v23.6,16 | v29.4,17.6 v29.4,25.6
  Bottom 0.2: SV1.14 23.65,32.75 26.8,29.6 26.8,27.8 28.6,26 29,26 v29.4,25.6 | v23.6,16 24,16.4 25.8,16.4 27,17.6 v29.4,17.6
CAS  (via drill 0.2)
  Top 0.127: U3.17 71.2,24.6 71.6,24.2 71.6,19.2 v71.4,19 71.2,18.8 U2.17 | v50.2,14.8 50.55,14.45 U1.177
  Bottom 0.127: v71.4,19 66.85,14.45 65.88,14.45 arc-90 65.89,14.44 arc90 65.7,14.63 65.7,14.63 arc90 65.51,14.44 arc-90 65.32,14.25 65.31,14.25 arc-90 65.12,14.44 arc90 64.93,14.63 64.93,14.63 arc90 64.74,14.44 arc-90 64.55,14.25 64.55,14.25 arc-90 64.36,14.44 arc90 64.17,14.63 64.17,14.63 arc90 63.98,14.44 arc-90 63.78,14.25 63.78,14.25 arc-90 63.59,14.44 arc90 63.4,14.63 63.4,14.63 arc90 63.21,14.44 arc-90 63.02,14.25 63.02,14.25 arc-90 62.83,14.44 arc90 62.63,14.63 62.63,14.63 arc90 62.44,14.44 arc-90 62.25,14.25 62.25,14.25 arc-90 62.06,14.44 arc90 61.87,14.63 61.87,14.63 arc90 61.67,14.44 arc-90 61.48,14.25 61.48,14.25 arc-90 61.29,14.44 arc90 61.1,14.63 61.1,14.63 arc90 60.91,14.44 arc-90 60.72,14.25 60.72,14.25 arc-90 60.52,14.44 arc90 60.33,14.63 60.33,14.63 arc90 60.14,14.44 arc-90 59.95,14.25 59.95,14.25 arc-90 59.76,14.44 arc90 59.57,14.63 59.56,14.63 arc90 59.37,14.44 arc-90 59.18,14.25 59.18,14.25 arc-90 58.99,14.44 arc90 58.8,14.63 58.8,14.63 arc90 58.61,14.44 arc-90 58.42,14.25 58.41,14.25 arc-90 58.22,14.44 arc90 58.03,14.63 58.03,14.63 arc90 57.84,14.44 arc-90 57.65,14.25 57.65,14.25 arc-90 57.46,14.44 arc90 57.27,14.63 57.27,14.63 arc90 57.07,14.44 arc-90 56.88,14.25 56.88,14.25 arc-90 56.69,14.44 arc90 56.5,14.63 56.5,14.63 arc90 56.31,14.44 arc-90 56.12,14.25 56.12,14.25 arc-90 55.92,14.44 arc90 55.73,14.63 55.73,14.63 arc90 55.54,14.44 arc-90 55.35,14.25 55.35,14.25 arc-90 55.16,14.44 arc90 54.97,14.63 54.96,14.63 arc90 54.77,14.44 arc-90 54.58,14.25 54.58,14.25 arc-90 54.39,14.44 arc90 54.2,14.63 54.2,14.63 arc90 54.01,14.44 arc-90 53.82,14.25 53.81,14.25 arc-90 53.62,14.44 arc90 53.43,14.63 53.43,14.63 arc90 53.24,14.44 arc-90 53.05,14.25 50.75,14.25 v50.2,14.8
CFIOR_NBS1_NWR1  (via drill 0.2)
  Top 0.127: U2.39 70.4,24.2 70,24.6 70,28.8 v69.4,29.4 | U1.172 49.45,11.95 47.8,13.6 v47.8,22.8
  Bottom 0.127: v69.4,29.4 62.8,22.8 v47.8,22.8
CFIOW_NBS3_NWR3  (via drill 0.2)
  Top 0.127: 70.4,37.6 70.2,37.4 v70.2,29.4 | v48.4,22.4 48.4,13.8 49.75,12.45 U1.173
  Top 0.2: U3.39 70.4,37.6
  Bottom 0.127: v70.2,29.4 63.2,22.4 v48.4,22.4
DATA0
  Top 0.127: U1.179 53,15.45 53.39,15.06 53.39,11.09 arc90 53.58,10.9 53.68,10.9 arc90 53.87,11.09 53.87,12.21 arc-90 54.06,12.4 54.16,12.4 arc-90 54.35,12.21 54.35,11.09 arc90 54.54,10.9 54.64,10.9 arc90 54.83,11.09 54.83,12.21 arc-90 55.02,12.4 55.12,12.4 arc-90 55.3,12.21 55.3,11.09 arc90 55.5,10.9 55.59,10.9 arc90 55.78,11.09 55.78,12.21 arc-90 55.98,12.4 56.07,12.4 arc-90 56.26,12.21 56.26,11.09 arc90 56.45,10.9 56.55,10.9 arc90 56.74,11.09 56.74,12.21 arc-90 56.93,12.4 57.15,12.4 57.65,12.9 58.7,12.9 59.2,12.4 U2.2
DATA1
  Top 0.127: U1.180 53.05,15.95 53.8,15.2 53.8,13.39 arc90 53.99,13.2 54.02,13.2 arc90 54.21,13.39 54.21,13.81 arc-90 54.4,14 54.44,14 arc-90 54.62,13.81 54.62,13.39 arc90 54.82,13.2 54.85,13.2 arc90 55.04,13.39 55.04,13.81 arc-90 55.23,14 55.26,14 arc-90 55.45,13.81 55.45,13.39 arc90 55.64,13.2 55.68,13.2 arc90 55.87,13.39 55.87,13.81 arc-90 56.06,14 56.09,14 arc-90 56.28,13.81 56.28,13.39 arc90 56.47,13.2 56.51,13.2 arc90 56.7,13.39 56.7,13.81 arc-90 56.89,14 56.92,14 arc-90 57.11,13.81 57.11,13.39 arc90 57.3,13.2 57.33,13.2 arc90 57.52,13.39 57.52,13.81 arc-90 57.72,14 57.75,14 arc-90 57.94,13.81 57.94,13.39 arc90 58.13,13.2 58.16,13.2 arc90 58.35,13.39 58.35,13.81 arc-90 58.54,14 58.58,14 arc-90 58.77,13.81 58.77,13.39 arc90 58.96,13.2 58.99,13.2 arc90 59.18,13.39 59.18,13.81 arc-90 59.37,14 59.41,14 arc-90 59.59,13.81 59.59,13.39 arc90 59.79,13.2 59.97,13.2 60.8,12.37 U2.4
DATA2
  Top 0.127: U1.181 53.35,16.45 54.2,15.6 54.2,14.8 54.39,14.61 54.39,14.59 arc90 54.58,14.4 54.61,14.4 arc90 54.8,14.59 54.8,14.61 arc-90 54.99,14.8 55.01,14.8 arc-90 55.2,14.61 55.2,14.59 arc90 55.39,14.4 55.42,14.4 arc90 55.61,14.59 55.61,14.61 arc-90 55.8,14.8 55.82,14.8 arc-90 56.01,14.61 56.01,14.59 arc90 56.2,14.4 56.23,14.4 arc90 56.42,14.59 56.42,14.61 arc-90 56.61,14.8 56.63,14.8 arc-90 56.82,14.61 56.82,14.59 arc90 57.01,14.4 57.04,14.4 arc90 57.23,14.59 57.23,14.61 arc-90 57.42,14.8 57.44,14.8 arc-90 57.63,14.61 57.63,14.59 arc90 57.83,14.4 57.85,14.4 arc90 58.04,14.59 58.04,14.61 arc-90 58.23,14.8 58.26,14.8 arc-90 58.45,14.61 58.45,14.59 arc90 58.64,14.4 58.66,14.4 arc90 58.85,14.59 58.85,14.61 arc-90 59.04,14.8 59.07,14.8 arc-90 59.26,14.61 59.26,14.59 arc90 59.45,14.4 59.47,14.4 arc90 59.66,14.59 59.66,14.61 arc-90 59.85,14.8 59.88,14.8 arc-90 60.07,14.61 60.07,14.59 arc90 60.26,14.4 61.6,13.06 U2.5
DATA3
  Top 0.127: U1.182 52.19,17 53.45,17 55,15.45 55.03,15.45 arc-90 55.22,15.26 arc90 55.41,15.07 55.43,15.07 arc90 55.62,15.26 55.62,15.64 arc-90 55.81,15.83 55.83,15.83 arc-90 56.02,15.64 56.02,15.26 arc90 56.21,15.07 56.23,15.07 arc90 56.42,15.26 56.42,15.64 arc-90 56.61,15.83 56.63,15.83 arc-90 56.82,15.64 56.82,15.26 arc90 57.01,15.07 57.03,15.07 arc90 57.22,15.26 57.22,15.64 arc-90 57.41,15.83 57.43,15.83 arc-90 57.62,15.64 57.62,15.26 arc90 57.81,15.07 57.83,15.07 arc90 58.02,15.26 58.02,15.64 arc-90 58.21,15.83 58.22,15.83 arc-90 58.41,15.64 58.41,15.26 arc90 58.6,15.07 58.62,15.07 arc90 58.81,15.26 58.81,15.64 arc-90 59,15.83 59.02,15.83 arc-90 59.21,15.64 59.21,15.26 arc90 59.4,15.07 59.42,15.07 arc90 59.61,15.26 59.61,15.64 arc-90 59.8,15.83 59.82,15.83 arc-90 60.01,15.64 60.01,15.26 arc90 60.2,15.07 60.22,15.07 arc90 60.41,15.26 arc-90 60.6,15.45 63.2,12.85 U2.7
DATA4
  Top 0.127: U1.185 54.95,18.45 56.2,17.2 56.2,16.6 56.58,16.22 56.62,16.22 arc90 56.81,16.41 56.81,16.79 arc-90 57.01,16.98 57.05,16.98 arc-90 57.24,16.79 57.24,16.41 arc90 57.43,16.22 57.47,16.22 arc90 57.66,16.41 57.66,16.79 arc-90 57.85,16.98 57.9,16.98 arc-90 58.09,16.79 58.09,16.41 arc90 58.28,16.22 58.32,16.22 arc90 58.51,16.41 58.51,16.79 arc-90 58.7,16.98 58.75,16.98 arc-90 58.94,16.79 58.94,16.41 arc90 59.13,16.22 59.17,16.22 arc90 59.36,16.41 59.36,16.79 arc-90 59.55,16.98 59.59,16.98 arc-90 59.78,16.79 59.78,16.41 arc90 59.98,16.22 60.02,16.22 arc90 60.21,16.41 arc-90 60.4,16.6 60.8,16.6 64,13.4 U2.8
DATA5
  Top 0.127: U2.10 65.6,12.8 61,17.4 56.95,17.4 55.55,18.8 53.4,18.8 53.25,18.95 U1.186
DATA6
  Top 0.127: U2.11 66.4,12.8 61.2,18 57,18 55.8,19.2 53.75,19.2 53.5,19.45 U1.187
DATA7
  Top 0.127: U1.190 55.05,20.95 57.4,18.6 62.2,18.6 68,12.8
  Top 0.2: 68,12.8 U2.13
DATA8
  Top 0.127: U1.191 53.14,21.45 53.29,21.3 55,21.3 55.3,21.3 57.4,19.2 64,19.2 64.5,19.7 arc-90 64.77,19.7 64.79,19.68 arc90 65.06,19.68 65.09,19.72 arc90 65.09,19.98 65.07,20 arc-90 65.07,20.27 65.11,20.31 arc-90 65.38,20.31 65.4,20.29 arc90 65.67,20.29 65.7,20.32 arc90 65.7,20.59 65.68,20.61 arc-90 65.68,20.88 65.72,20.92 arc-90 65.99,20.92 66.01,20.9 arc90 66.28,20.9 66.31,20.93 arc90 66.31,21.2 66.29,21.22 arc-90 66.29,21.49 66.33,21.53 arc-90 66.6,21.53 66.62,21.51 arc90 66.89,21.51 66.92,21.54 arc90 66.92,21.81 66.9,21.83 arc-90 66.9,22.1 66.94,22.14 arc-90 67.21,22.14 67.23,22.12 arc90 67.5,22.12 67.53,22.15 arc90 67.53,22.42 67.51,22.44 arc-90 67.51,22.71 68,23.2 U2.42
DATA9
  Top 0.127: U1.192 53.19,21.95 53.44,21.7 55.5,21.7 57.6,19.6 63.4,19.6 63.5,19.7 arc-90 63.77,19.7 arc90 64.04,19.7 64.06,19.72 arc90 64.06,19.99 arc-90 64.06,20.26 64.08,20.29 arc-90 64.35,20.29 arc90 64.62,20.29 64.65,20.31 arc90 64.65,20.58 arc-90 64.65,20.85 64.67,20.87 arc-90 64.94,20.87 arc90 65.21,20.87 65.23,20.89 arc90 65.23,21.16 arc-90 65.23,21.43 65.25,21.45 arc-90 65.52,21.45 arc90 65.79,21.45 65.81,21.48 arc90 65.81,21.75 arc-90 65.81,22.02 65.84,22.04 arc-90 66.11,22.04 arc90 66.38,22.04 66.4,22.06 arc90 66.4,22.33 arc-90 66.4,22.6 U2.44
DATA10
  Top 0.127: U1.193 53.34,22.45 53.74,22.05 55.7,22.05 57.75,20 62.8,20 62.9,20.1 arc-90 63.17,20.1 arc90 63.44,20.1 63.47,20.14 arc90 63.47,20.41 63.2,20.67 arc-90 63.2,20.94 63.24,20.98 arc-90 63.51,20.98 63.78,20.71 arc90 64.05,20.71 64.08,20.75 arc90 64.08,21.01 63.81,21.28 arc-90 63.81,21.55 63.85,21.59 arc-90 64.12,21.59 64.39,21.32 arc90 64.66,21.32 64.69,21.35 arc90 64.69,21.62 64.42,21.89 arc-90 64.42,22.16 64.46,22.2 arc-90 64.73,22.2 65,21.93 arc90 65.27,21.93 65.3,21.96 arc90 65.3,22.23 arc-90 65.3,22.5 65.6,22.8 U2.45
DATA11
  Top 0.127: U1.194 53.54,22.95 54.09,22.4 55.9,22.4 57.9,20.4 58,20.4 arc90 58.19,20.59 58.19,20.61 arc-90 58.38,20.8 58.4,20.8 arc-90 58.59,20.61 58.59,20.59 arc90 58.78,20.4 58.79,20.4 arc90 58.98,20.59 58.98,20.61 arc-90 59.17,20.8 59.19,20.8 arc-90 59.38,20.61 59.38,20.59 arc90 59.57,20.4 59.59,20.4 arc90 59.78,20.59 59.78,20.61 arc-90 59.97,20.8 59.98,20.8 arc-90 60.17,20.61 60.17,20.59 arc90 60.37,20.4 60.38,20.4 arc90 60.57,20.59 60.57,20.61 arc-90 60.76,20.8 60.78,20.8 arc-90 60.97,20.61 60.97,20.59 arc90 61.16,20.4 61.18,20.4 arc90 61.37,20.59 61.37,20.61 arc-90 61.56,20.8 61.57,20.8 arc-90 61.76,20.61 61.76,20.59 arc90 61.95,20.4 62,20.4 arc90 62.19,20.59 62.19,21.09 62.07,21.2 arc-90 62.07,21.47 62.08,21.48 arc-90 62.35,21.48 62.58,21.25 arc90 62.85,21.25 62.86,21.26 arc90 62.86,21.53 62.63,21.76 arc-90 62.63,22.03 62.64,22.04 arc-90 62.91,22.04 63.14,21.81 arc90 63.41,21.81 63.42,21.82 arc90 63.42,22.09 63.19,22.32 arc-90 63.19,22.59 63.21,22.61 arc-90 63.48,22.61 63.71,22.38 arc90 63.98,22.38 64,22.4 U2.47
DATA12  (via drill 0.2)
  Top 0.127: U2.48 63.2,24.1 v62.95,24.35 | v53.6,23.45 U1.195
  Bottom 0.127: v62.95,24.35 62.95,23.55 62.8,23.4 62.73,23.4 arc-90 62.54,23.59 62.54,23.75 arc90 62.35,23.94 62.33,23.94 arc90 62.14,23.75 62.14,23.59 arc-90 61.95,23.4 61.93,23.4 arc-90 61.74,23.59 61.74,23.75 arc90 61.55,23.94 61.54,23.94 arc90 61.34,23.75 61.34,23.59 arc-90 61.16,23.4 61.14,23.4 arc-90 60.95,23.59 60.95,23.75 arc90 60.76,23.94 60.74,23.94 arc90 60.55,23.75 60.55,23.59 arc-90 60.36,23.4 60.34,23.4 arc-90 60.15,23.59 60.15,23.75 arc90 59.96,23.94 59.95,23.94 arc90 59.76,23.75 59.76,23.59 arc-90 59.56,23.4 59.55,23.4 arc-90 59.36,23.59 59.36,23.75 arc90 59.17,23.94 59.15,23.94 arc90 58.96,23.75 58.96,23.59 arc-90 58.77,23.4 58.75,23.4 arc-90 58.56,23.59 58.56,23.75 arc90 58.37,23.94 58.36,23.94 arc90 58.16,23.75 58.16,23.59 arc-90 57.98,23.4 57.96,23.4 arc-90 57.77,23.59 57.77,23.75 arc90 57.58,23.94 57.56,23.94 arc90 57.37,23.75 57.37,23.59 arc-90 57.18,23.4 57.16,23.4 arc-90 56.97,23.59 56.97,23.75 arc90 56.78,23.94 56.77,23.94 arc90 56.58,23.75 56.58,23.59 arc-90 56.38,23.4 56.37,23.4 arc-90 56.18,23.59 56.18,23.75 arc90 55.99,23.94 55.97,23.94 arc90 55.78,23.75 55.78,23.59 arc-90 55.59,23.4 55.57,23.4 arc-90 55.38,23.59 55.38,23.75 arc90 55.19,23.94 55.18,23.94 arc90 54.98,23.75 54.98,23.59 arc-90 54.8,23.4 54.78,23.4 arc-90 54.59,23.59 54.59,23.75 arc90 54.4,23.94 54.38,23.94 arc90 54.19,23.75 54.19,23.59 arc-90 54,23.4 53.65,23.4 v53.6,23.45
DATA13
  Top 0.127: U2.50 61.6,23.28 61.4,23.08 61.4,21.4 arc-90 61.2,21.2 61.2,21.2 arc-90 61.01,21.39 61.01,22.41 arc90 60.82,22.6 60.79,22.6 arc90 60.6,22.41 60.6,21.39 arc-90 60.41,21.2 60.39,21.2 arc-90 60.2,21.39 60.2,22.41 arc90 60.01,22.6 59.99,22.6 arc90 59.8,22.41 59.8,21.39 arc-90 59.61,21.2 59.58,21.2 arc-90 59.39,21.39 59.39,22.41 arc90 59.2,22.6 59.18,22.6 arc90 58.99,22.41 58.99,21.39 arc-90 58.8,21.2 58.4,21.2 56.4,23.2 54.6,23.2 53.85,23.95 U1.196
DATA14  (via drill 0.2)
  Top 0.127: U2.51 60.8,23.8 61.2,24.2 v61.2,24.4 | U1.197 54.55,24.45 v54.6,24.4
  Bottom 0.127: v54.6,24.4 55.2,24.4 55.85,25.05 55.94,25.05 arc-90 56.13,24.86 56.13,24.4 arc90 56.32,24.21 56.33,24.21 arc90 56.52,24.4 56.52,25.7 arc-90 56.71,25.89 56.71,25.89 arc-90 56.9,25.7 56.9,24.4 arc90 57.09,24.21 57.09,24.21 arc90 57.28,24.4 57.28,25.7 arc-90 57.47,25.89 57.47,25.89 arc-90 57.66,25.7 57.66,24.4 arc90 57.85,24.21 57.85,24.21 arc90 58.05,24.4 58.05,25.7 arc-90 58.23,25.89 58.24,25.89 arc-90 58.43,25.7 58.43,24.4 arc90 58.62,24.21 58.62,24.21 arc90 58.81,24.4 58.81,24.86 arc-90 59,25.05 60.55,25.05 v61.2,24.4
DATA15
  Top 0.127: U1.198 55.2,24.95 arc-90 55.39,24.76 55.39,23.79 arc90 55.58,23.6 55.61,23.6 arc90 55.8,23.79 55.8,25.36 arc-90 55.99,25.55 56.02,25.55 arc-90 56.21,25.36 56.21,23.79 arc90 56.4,23.6 56.43,23.6 arc90 56.62,23.79 56.62,25.36 arc-90 56.81,25.55 56.84,25.55 arc-90 57.03,25.36 57.03,23.19 arc90 57.22,23 57.25,23 arc90 57.44,23.19 57.44,25.36 arc-90 57.63,25.55 57.65,25.55 arc-90 57.85,25.35 57.85,22.95 58.2,22.6 58.55,22.6 59.2,23.25 U2.53
DATA16
  Top 0.127: U1.201 53.14,26.45 53.39,26.7 55.25,26.7 arc90 55.4,26.85 55.4,27.5 arc-90 55.6,27.7 arc-90 55.79,27.51 55.79,26.26 arc90 55.98,26.07 56.01,26.07 arc90 56.2,26.26 56.2,28.34 arc-90 56.41,28.55 arc-90 56.61,28.34 56.61,26.26 arc90 56.8,26.07 56.83,26.07 arc90 57.02,26.26 57.02,28.74 arc-90 57.22,28.93 57.25,28.93 arc-90 57.44,28.74 57.44,26.66 arc90 57.63,26.46 57.66,26.46 arc90 57.85,26.66 57.85,27.8 arc-90 58.05,28 59,28 arc-90 59.2,27.8 59.2,26.92 | U3.2 59.2,26.92 | 59.2,26.92 arc-90 59.2,26.92
DATA17  (via drill 0.2)
  Top 0.127: U3.4 60.8,26.7 60.1,27.4 v59.8,27.4 | v50.4,27 50.45,26.95 U1.202
  Bottom 0.127: v59.8,27.4 59.7,27.4 arc-90 59.52,27.59 arc90 59.32,27.78 59.1,27.78 arc90 58.91,27.59 58.91,27.21 arc-90 58.72,27.02 58.49,27.02 arc-90 58.3,27.21 58.3,27.59 arc90 58.1,27.78 57.88,27.78 arc90 57.69,27.59 57.69,27.21 arc-90 57.5,27.02 57.27,27.02 arc-90 57.08,27.21 57.08,27.59 arc90 56.89,27.78 56.66,27.78 arc90 56.47,27.59 56.47,27.21 arc-90 56.28,27.02 56.05,27.02 arc-90 55.86,27.21 55.86,27.59 arc90 55.67,27.78 55.44,27.78 arc90 55.25,27.59 55.25,27.21 arc-90 55.06,27.02 54.83,27.02 arc-90 54.64,27.21 54.64,27.59 arc90 54.45,27.78 54.22,27.78 arc90 54.03,27.59 54.03,27.21 arc-90 53.84,27.02 53.61,27.02 arc-90 53.42,27.21 53.42,27.59 arc90 53.23,27.78 53,27.78 arc90 52.81,27.59 52.81,27.21 arc-90 52.62,27.02 52.39,27.02 arc-90 52.2,27.21 52.2,27.59 arc90 52.01,27.78 51.78,27.78 arc90 51.59,27.59 arc-90 51.4,27.4 50.8,27.4 v50.4,27
DATA18
  Top 0.127: U3.5 61.6,26.8 61.31,27.09 arc-90 61.31,27.36 61.43,27.49 arc90 61.43,27.76 61.42,27.77 arc90 61.15,27.77 60.83,27.45 arc-90 60.55,27.45 arc-90 60.55,27.73 60.87,28.05 arc90 60.87,28.32 60.86,28.34 arc90 60.59,28.34 60.26,28.01 arc-90 59.98,28.01 arc-90 59.98,28.29 60.31,28.62 arc90 60.31,28.89 60.29,28.9 arc90 60.02,28.9 59.5,28.38 arc-90 59.23,28.38 59.22,28.39 arc-90 59.22,28.66 59.74,29.18 arc90 59.74,29.45 59.73,29.46 arc90 59.46,29.46 58.94,28.94 arc-90 58.67,28.94 58.66,28.95 arc-90 58.66,29.22 59.18,29.75 arc90 59.18,30.02 59.17,30.03 arc90 58.9,30.03 58.77,29.9 arc-90 58.5,29.9 58.1,30.3 57.3,30.3 54.45,27.45 U1.203
DATA19
  Top 0.127: U3.7 63.2,27.5 arc90 62.98,27.5 62.93,27.45 arc-90 62.66,27.45 arc-90 62.66,27.72 62.71,27.77 arc90 62.71,28.04 62.71,28.04 arc90 62.44,28.04 62.19,27.79 arc-90 61.92,27.79 61.92,27.79 arc-90 61.92,28.06 62.17,28.31 arc90 62.17,28.58 62.17,28.58 arc90 61.9,28.58 61.65,28.33 arc-90 61.38,28.33 61.38,28.33 arc-90 61.38,28.6 61.63,28.85 arc90 61.63,29.12 61.62,29.12 arc90 61.36,29.12 61.11,28.88 arc-90 60.84,28.88 60.83,28.88 arc-90 60.83,29.15 61.09,29.4 arc90 61.09,29.66 61.08,29.67 arc90 60.81,29.67 60.56,29.42 arc-90 60.29,29.42 60.29,29.42 arc-90 60.29,29.69 60.54,29.94 arc90 60.54,30.21 60.54,30.21 arc90 60.27,30.21 60.02,29.96 arc-90 59.75,29.96 59.75,29.96 arc-90 59.75,30.23 59.8,30.28 arc90 59.8,30.7 56.95,30.7 54.25,28 52.19,28 U1.204
DATA20
  Top 0.127: U3.8 64,27.2 63.98,27.22 arc-90 63.98,27.49 64.17,27.69 arc90 64.17,27.96 64.13,28 arc90 63.87,28 63.67,27.8 arc-90 63.4,27.8 63.36,27.84 arc-90 63.36,28.11 63.55,28.31 arc90 63.55,28.58 63.51,28.62 arc90 63.24,28.62 63.05,28.42 arc-90 62.78,28.42 62.74,28.46 arc-90 62.74,28.73 62.94,28.93 arc90 62.94,29.2 62.89,29.24 arc90 62.62,29.24 62.43,29.04 arc-90 62.16,29.04 62.12,29.08 arc-90 62.12,29.35 62.31,29.55 arc90 62.31,29.82 62.27,29.86 arc90 62.01,29.86 61.81,29.66 arc-90 61.54,29.66 61.5,29.7 arc-90 61.5,29.97 61.7,30.17 arc90 61.7,30.43 61.65,30.48 arc90 61.38,30.48 61.19,30.28 arc-90 60.92,30.28 60.88,30.32 arc-90 60.88,30.59 61.08,30.79 arc90 61.08,31.05 61.03,31.1 arc90 60.77,31.1 60.57,30.9 arc-90 60.3,30.9 60.1,31.1 56.5,31.1 53.85,28.45 U1.205
DATA21
  Top 0.127: U3.10 65.6,27 65.53,27.07 arc-90 65.53,27.34 65.57,27.38 arc90 65.57,27.65 65.56,27.65 arc90 65.3,27.65 65.26,27.61 arc-90 64.99,27.61 64.99,27.61 arc-90 64.99,27.88 65.03,27.92 arc90 65.03,28.19 65.02,28.19 arc90 64.75,28.19 64.72,28.15 arc-90 64.45,28.15 64.45,28.15 arc-90 64.45,28.42 64.48,28.46 arc90 64.48,28.73 64.48,28.73 arc90 64.21,28.73 64.18,28.69 arc-90 63.91,28.69 63.91,28.7 arc-90 63.91,28.96 63.94,29 arc90 63.94,29.27 63.94,29.27 arc90 63.67,29.27 63.63,29.23 arc-90 63.37,29.23 63.36,29.24 arc-90 63.36,29.51 63.4,29.54 arc90 63.4,29.81 63.4,29.81 arc90 63.13,29.81 63.09,29.78 arc-90 62.82,29.78 62.82,29.78 arc-90 62.82,30.05 62.86,30.08 arc90 62.86,30.35 62.86,30.36 arc90 62.59,30.36 62.55,30.32 arc-90 62.28,30.32 62.28,30.32 arc-90 62.28,30.59 62.32,30.62 arc90 62.32,30.89 62.32,30.9 arc90 62.05,30.9 62.01,30.86 arc-90 61.74,30.86 61.74,30.86 arc-90 61.74,31.13 61.78,31.17 arc90 61.78,31.44 61.78,31.44 arc90 61.51,31.44 61.47,31.4 arc-90 61.2,31.4 61.1,31.5 56.1,31.5 53.55,28.95 U1.206
DATA22
  Top 0.127: U1.207 53.25,29.45 55.7,31.9 61.9,31.9 62.4,31.4 arc90 62.67,31.4 62.7,31.43 arc-90 62.97,31.43 63,31.4 arc-90 63,31.13 62.97,31.1 arc90 62.97,30.83 63,30.8 arc90 63.27,30.8 63.3,30.83 arc-90 63.57,30.83 63.6,30.8 arc-90 63.6,30.54 63.57,30.5 arc90 63.57,30.23 63.6,30.2 arc90 63.87,30.2 63.9,30.23 arc-90 64.17,30.23 64.2,30.2 arc-90 64.2,29.94 64.17,29.9 arc90 64.17,29.63 64.2,29.6 arc90 64.47,29.6 64.5,29.64 arc-90 64.77,29.64 64.8,29.61 arc-90 64.8,29.34 64.77,29.3 arc90 64.77,29.04 64.8,29 arc90 65.06,29 65.1,29.04 arc-90 65.37,29.04 65.4,29.01 arc-90 65.4,28.74 65.36,28.71 arc90 65.36,28.44 65.39,28.41 arc90 65.66,28.41 65.7,28.44 arc-90 65.97,28.44 66,28.41 arc-90 66,28.14 65.96,28.11 arc90 65.96,27.84 66.4,27.4 U3.11
DATA23
  Top 0.127: U1.208 52.95,29.95 55.3,32.3 63.1,32.3 63.6,31.8 arc90 63.87,31.8 63.88,31.82 arc-90 64.16,31.82 64.44,31.53 arc-90 64.44,31.26 64.43,31.24 arc90 64.43,30.97 64.72,30.68 arc90 64.99,30.68 65,30.7 arc-90 65.27,30.7 65.56,30.41 arc-90 65.56,30.14 65.55,30.12 arc90 65.55,29.85 65.84,29.56 arc90 66.11,29.56 66.12,29.58 arc-90 66.39,29.58 66.68,29.29 arc-90 66.68,29.02 66.67,29 arc90 66.67,28.73 68,27.4 68,26.8
  Top 0.2: U3.13 | U3.13 | U3.13 68,26.8
DATA24  (via drill 0.2)
  Top 0.127: U1.1 49.75,31.45 50.2,31 v50.2,30.8 | v67.2,36.8 68,37.6
  Top 0.2: 68,37.6 68,37.8 U3.42
  Bottom 0.127: v50.2,30.8 61.2,30.8 v67.2,36.8
DATA25  (via drill 0.2)
  Top 0.127: U1.2 49.25,31.35 49.6,31 v49.6,30.8 | v65.6,36.8 66.4,37.6
  Top 0.2: 66.4,37.6 U3.44
  Bottom 0.127: v49.6,30.8 50.2,31.4 60.2,31.4 v65.6,36.8
DATA26  (via drill 0.2)
  Top 0.127: U1.3 48.75,31.25 49,31 v49,30.8 | v64.8,36.8 65.6,37.6
  Top 0.2: 65.6,37.6 U3.45
  Bottom 0.127: v49,30.8 50,31.8 59.8,31.8 v64.8,36.8
DATA27  (via drill 0.2)
  Top 0.127: U1.4 48.25,31.15 48.4,31 v48.4,30.8 | v63.2,36.8 64,37.6 U3.47
  Bottom 0.127: v48.4,30.8 49.8,32.2 58.6,32.2 v63.2,36.8
DATA28  (via drill 0.2)
  Top 0.127: U1.5 47.75,30.85 v47.8,30.8 | v62.4,36.8 63.2,37.6
  Top 0.2: 63.2,37.6 U3.48
  Bottom 0.127: v47.8,30.8 49.6,32.6 58.2,32.6 v62.4,36.8
DATA29  (via drill 0.2)
  Top 0.127: U1.6 47.25,30.85 v47.2,30.8 | U3.50 v61.6,36.8
  Bottom 0.127: v47.2,30.8 49.4,33 57.8,33 v61.6,36.8
DATA30  (via drill 0.2)
  Top 0.127: U1.9 45.75,30.95 v45.6,30.8 | U3.51 v60.8,36.8
  Bottom 0.127: v60.8,36.8 57.4,33.4 49.2,33.4 47.4,31.6 46.4,31.6 v45.6,30.8
DATA31  (via drill 0.2)
  Top 0.127: U1.10 45.25,31.05 v45,30.8
  Top 0.2: U3.53 v59.2,37
  Bottom 0.127: v59.2,37 59.2,36.2 56.8,33.8 49,33.8 47.2,32 46.2,32 v45,30.8
FIQ  (via drill 0.3)
  Top 0.2: U1.123 33.25,6.15 33,6.4 33,17.2 32.6,17.6 32.6,20.8 33,21.2 v33,25.6
  Bottom 0.2: SV1.19 32.35,37.19 32.35,35.05 33.3,34.1 33.3,29.9 33,29.6 v33,25.6
GND  (via drill 0.3, 0.4, 0.6, 0.6 pad 0.9)
  Top 0.127: C11.2 | C11.2 54.55,17.95
  Top 0.2: U1.112 v27.75,3.65 28.15,3.65 28.25,3.55 | v30.25,4.45 U1.117 30.25,1.15 C15.2 | U1.130 36.75,2.95 v37.25,3.45 37.75,2.95 U1.132 37.75,1.25 C9.2 | v45.4,3.45 45.4,3.21 45.25,3.06 U1.147 45.25,0.95 C64.2 | v48.25,3.35 U1.153 48.25,0.95 C16.2 | v50.5,8.45 U1.165 53.65,8.45 C10.2 | v50.5,20.35 50.6,20.45 U1.189 53.6,20.45 C17.2 | v50.1,25.95 U1.200 53.65,25.95 C12.2 | v46,30.3 46,30.49 46.25,30.74 U1.8 46.25,33.25 C1.2 | 30.25,30.95 29.75,31.45 U1.41 29.75,33.25 C3.2 | 30.25,30.95 30.75,31.45 U1.39 30.75,33.65 C20.2 | v23.15,24.95 U1.63 20.45,24.95 C14.2 19.8,25.3 R36.1 | v23.55,18.6 23.4,18.45 U1.76 20.75,18.45 C5.2 | v23.5,9.45 U1.94 | U1.184 54.55,17.95 C11.2 | v58.6,39 58.4,38.8 U3.54 57.47,36.95 C26.2 56.45,37.6 54.5,37.6 C25.2 | v60.2,39 60,38.8 U3.52 | U3.46 64.8,38.8 v65,39 C42.2 | U3.41 68.8,38.6 v69.2,39 C41.2 | 58.4,23.79 U2.54 58.4,24.3 C36.2 v59.5,24.5 C37.2 60.4,24.2 60,23.8 U2.52 | 62.4,26.3 U3.6 62.4,25.7 C35.2 v61.3,25.5 | U1.57 20.25,27.95 C4.2 20.01,28.01 v20.01,27.4 | 28.25,3.55 U1.113 28.25,0.75 C7.2 | U1.114 28.75,3.05 28.25,3.55 | 64.3,24.6 C38.2 | U2.46 64.8,23.88 64.29,24.39 C38.2 | 67.2,26.1 U3.12 | 66.6,25.5 66.4,25.5 C34.2 | C27.2 19.9,32.9 v19.4,32.4 19.7,32.1 C28.2 | U3.28 79.2,38.17 79.14,38.26 78.4,39 v78,39 | 54.05,39.15 54.3,39.4 55.3,39.4 v55.4,39.3 55.5,39.4 56.7,39.4 C21.2 | 54.05,39.15 C22.2 | 53.95,39.15 54.05,39.15 | C18.2 35,33.5 35.25,33.25 U1.30 35.25,30.95 v35.4,30.8 | C19.2 33.25,33.65 U1.34 33.25,30.45 33,30.2 v31.4,30.2 30.8,30.2 30.25,30.75 30.25,30.95 | C8.2 v34.15,0.7 | C51.2 R11.1 R12.1 C52.2 66.5,4.7 v66.6,4.6 | 5,22 5,21.75 | U7.7 6.46,24.36 6.45,24.35
  Top 0.2: U1.27 36.75,33.85 C2.2 36.8,34.2 v37.2,34.6 | U1.20 40.25,33.5 40.5,33.75 C13.2 41.2,34.6 v42.2,34.6 | U1.105 24.25,0.68 v24.2,0.63 | TP1.TP v53.4,3.4 | 19.2,10 C6.2 | IC4.3 13,30.52 13.8,31.32 13.8,32.7 R14.1 | C38.2 63.8,24.5 v63.5,24.8 | U1.184 | U1.184 v50.8,17.95
  Top 0.3: C29.2 v59.6,11 | C30.2 v62.6,11 62.6,11.6 62.4,11.8 U2.6 | 67.2,11.7 C31.2 | U2.12 67.2,11.7 | 67.2,11.7 C32.2 | U2.41 68.8,23.9 C39.2 67.4,24.5 66.4,25.5 | U2.28 C40.2 | C34.2 66.6,25.5 67.2,26.1 | U3.12 67.2,27.4 v66.6,28 | C24.2 20.3,33 C27.2 | C23.2 20.5,31.8 C28.2 | C63.2 17.7,15.6 v17.8,15.6
  Top 0.4: U4.1 73.72,10.23 C58.2 74.55,11 v74.6,11 | 78.15,10.3 C59.2 78.2,10.15 R17.2 | 78.15,10.3 77.45,11 v77.4,11 | C33.2 78.15,10.3 | C43.2 C53.2 67.95,7.05 v68,7 | R19.2 66.25,9.15 C60.2 66.5,10.25 C31.2 v67.2,11 C32.2 | U5.1 61.58,9.83 C61.2 61.9,10.15 C30.2 | C55.2 C54.2 55.55,8.6 v55,8.6 54.9,8.7 C10.2 | U2.28 79.2,22.57 v79.37,22.4 | 14.25,7.15 CON2.GND4 15.15,8.2 C44.2 | C44.2 15.5,8.15 | 5,22 5,22.75 C62.2 5.2,23.1 6.45,24.35 | C46.2 9.55,33.9 v8.5,33.9 | v8.5,32.05 7.5,32.05 C45.2 7.4,32.1 IC4.5 | v12.2,34.8 11.8,34.4 C47.2 12.65,33.85 R14.1 | CON1.5 CON1.SH2 | CON1.SH4 CON1.SH5 CON1.SH6 CON1.SH7 CON1.SH8 | C65.2 C44.2 | U6.2 18.6,9.8 v18.3,10.1 C6.2 19.2,10.9 | 19.2,10.9 C48.2 | 19.2,10.9 19.4,10.9 C49.2
  Top 0.6: CON2.GND2 5,21.75 6.25,21.75 v6.4,21.6 | CON2.GND3 6.25,6.25 v6.4,6.4 | CON2.GND4 14.1,7.3 v11.8,9.6 | CON2.GND1 11.55,21.75 v10.2,20.4 | CON2.P$6 13.25,17.25 v13.2,17.2
  Bottom 0.2: v29.85,6.05 29.85,6.65 GND.TP
  pour Route2 (isolate 0.3, rank 6, no thermals): -1,-1 -1,41 81,41 81,-1
  pour Top (isolate 0.3, no thermals): 0.4,22 15,22 15,7.6 14.8,7.4 14.8,5.6 2.4,5.6 2.4,15.4 0.4,15.4
GPIO2  (via drill 0.3)
  Top 0.2: U1.48 26.25,31.15 31.2,26.2 v33.6,26.2
  Bottom 0.2: SV1.21 32.75,37.21 32.75,35.25 33.75,34.25 33.75,29.75 33.6,29.6 v33.6,26.2
GPIO3  (via drill 0.3)
  Top 0.2: v33.6,25 33.8,24.8 33.8,21.6 33.4,21.2 v33.4,20.23 | U1.78 22.95,17.45 23,17.4 24,17.4 24.2,17.6 24.2,19.3 v24.1,19.4
  Bottom 0.2: SV1.22 34.2,35.34 34.2,26 33.6,25.4 v33.6,25 | v33.4,20.23 33.23,20.4 26,20.4 25,19.4 v24.1,19.4 24.4,19.1 24.4,17.6 24.2,17.4 22,17.4 DRX.TP
HDMA  (via drill 0.3)
  Top 0.154: v59.45,5.1 59.45,4.95 60,4.4 60,4.3 R10.1
  Top 0.2: U1.125 v34.25,4
  Bottom 0.2: v59.45,5.1 59.28,5.1 58.28,6.1 55.3,6.1 53.2,4 v34.25,4
HDPA  (via drill 0.3)
  Top 0.154: R9.1 60.6,4.6 v60.1,5.1
  Top 0.2: v34.7,4.6 34.75,4.55 U1.126
  Bottom 0.2: v34.7,4.6 34.9,4.4 52.8,4.4 54.9,6.5 58.9,6.5 60.1,5.3 v60.1,5.1
HSE_IN  (via drill 0.3)
  Top 0.2: C25.1 55.2,36.7 55.2,35 55,34.8 55,34.65 Q1.1 54.1,33.75 54.1,32.5 52.8,31.2 51.4,31.2 49.2,29 43.8,29 v43.6,29.2 | v42.2,28 42,28.2 37.2,28.2 36,29.4 35.2,29.4 34.25,30.35 U1.32
  Bottom 0.2: v43.6,29.2 43.4,29.2 v42.2,28
HSE_OUT
  Top 0.154: Q1.3 55.6,34.75 55.6,33.8
  Top 0.2: Q1.3 56.1,36.15 C26.1 | 55.6,33.8 55.4,33.6 55.4,33.2 53,30.8 51.55,30.8 49.35,28.6 37.4,28.6 36.2,29.8 35.4,29.8 34.75,30.45 U1.31
I2C_SCL  (via drill 0.3)
  Top 0.2: v23.8,20.4 23.75,20.45 U1.72 20.95,20.45 20.1,19.6 R27.1 | v31.8,25.6 v31.8,20.9
  Bottom 0.2: SV1.17 27.4,36.94 27.4,35.4 26.2,34.2 26.2,33.2 27.8,31.6 28.4,31.6 31,29 31,26.95 31.8,26.15 v31.8,25.6 | v31.8,20.9 25.7,20.9 24.8,20 24.2,20 v23.8,20.4
I2C_SDA  (via drill 0.3)
  Top 0.2: v23.9,21.2 23.65,20.95 U1.71 20.45,20.95 R26.1 | v32.4,25 v32.4,21.4
  Bottom 0.2: SV1.18 28.33,35.73 26.6,34 26.6,33.4 28,32 28.6,32 31.4,29.2 31.4,27.35 32.4,26.35 v32.4,25 | v32.4,21.4 24.1,21.4 v23.9,21.2
IRQ0  (via drill 0.3)
  Top 0.2: U1.124 33.75,6.45 33.6,6.6 33.6,18.77 v33.4,18.97 | v30,25 v30,19.8
  Bottom 0.2: SV1.20 31.27,36.13 30,37.4 30,38.6 29.2,39.4 25.6,39.4 24.7,38.5 24.7,32.5 28.9,28.3 28.9,26.9 30,25.8 v30,25 | v30,19.8 32.57,19.8 v33.4,18.97
LED_B  (via drill 0.3)
  Top 0.2: U1.90 23.25,11.45 v23.4,11.6 | R20.1 v4.2,25.2